# Altium schematic sheet [02]-Thermistors.SchDoc: ENTER SHEET TITLE
size B; Engineer: ENTER ENGINEER NAME; Organization: CUAir; Address1: L3, 12a Rodborough Rd; Address2: Frenchs Forest; Address3: NSW; Address4: Australia 2086; Revision: ENTER REVISION NUMBER; CompetitionYear: 2019; CPN: ENTER CPN; PROJECT: ENTER PROJECT NAME
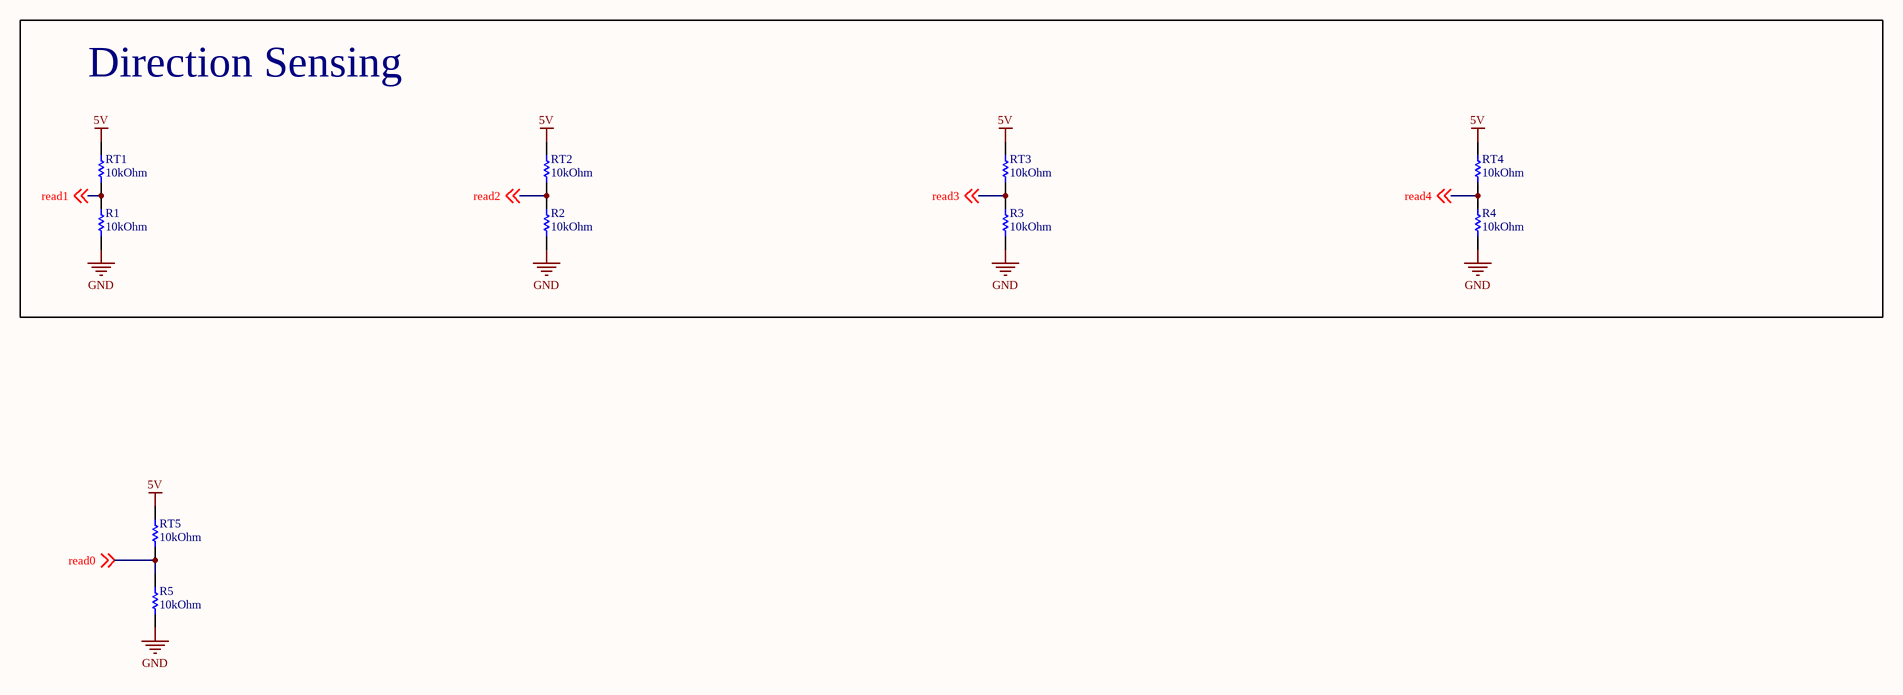
[diagram p0: [02]-Thermistors.SchDoc]

## Parts
R1  10kOhm  [RESC2013X60X35LL10T20]
R2  10kOhm  [RESC2013X60X35LL10T20]
R3  10kOhm  [RESC2013X60X35LL10T20]
R4  10kOhm  [RESC2013X60X35LL10T20]
R5  10kOhm  [RESC2013X60X35LL10T20]
RT1  10kOhm  [RESC2013X100X45NL20T25]
RT2  10kOhm  [RESC2013X100X45NL20T25]
RT3  10kOhm  [RESC2013X100X45NL20T25]
RT4  10kOhm  [RESC2013X100X45NL20T25]
RT5  10kOhm  [RESC2013X100X45NL20T25]

## Blocks framed on the sheet
Direction Sensing: R1-R4 RT1-RT4

## Nets
5V: RT1.2 RT2.2 RT3.2 RT4.2 RT5.2
GND: R1.1 R2.1 R3.1 R4.1 R5.1
read0: R5.2 RT5.1 ; off-sheet read0
read1: R1.2 RT1.1 ; off-sheet read1
read2: R2.2 RT2.1 ; off-sheet read2
read3: R3.2 RT3.1 ; off-sheet read3
read4: R4.2 RT4.1 ; off-sheet read4

## Notes on the sheet
- Project
- Title
- Size:
- Date:
- B
- Number:
- Revision:
- File:

## Library data of the parts
R1-R5 = CMP-1659-00013-2: RES 10.0K OHM 1/8W 1% 0805 SMD; MPN: RC0805FR-0710KL; Manufacturer: Yageo; PackageReference: 0805; ComponentLink1URL: http://www.yageo.com/documents/recent/PYu-RC_Group_51_RoHS_L_04.pdf; ComponentLink1Description: Datasheet; Value: 10kOhm
RT1-RT5 = CMP-2000-06827-1: Chip Thermistor, 10 KOhm, +/- 5%, 200 mW, -40 to 125 degC, 0805 (2012 Metric), RoHS, Tape and Reel; Manufacturer: Murata; MPN: NTCS0805E3103FLT; Value: 10kOhm; Type: NTC; Package Reference: 0805